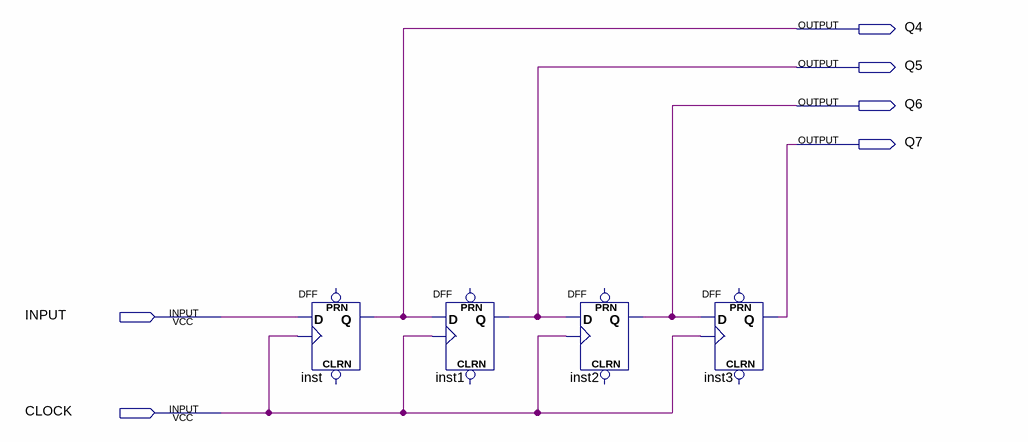
[diagram p0: schematic sheet]
// Quartus schematic 4_esc_registrador_paralelo_serie.bdf as structural Verilog: 4 symbols, 6 pins
module \4_esc_registrador_paralelo_serie  (
  input  INPUT,
  input  CLOCK,
  output Q4,
  output Q5,
  output Q6,
  output Q7
);

  DFF inst (.CLK(CLOCK), .D(INPUT), .Q(Q4));  // open: CLRN, PRN
  DFF inst1 (.CLK(CLOCK), .D(Q4), .Q(Q5));  // open: CLRN, PRN
  DFF inst2 (.CLK(CLOCK), .D(Q5), .Q(Q6));  // open: CLRN, PRN
  DFF inst3 (.CLK(CLOCK), .D(Q6), .Q(Q7));  // open: CLRN, PRN
endmodule
